# EasyEDA schematic SCH_SQIQ pod_2022-06-01.json
TITLE: Sheet_1; REV: 1.0; Date: 2022-06-01; Sheet: 1/1; Drawn By: suja8742; Company: Your Company
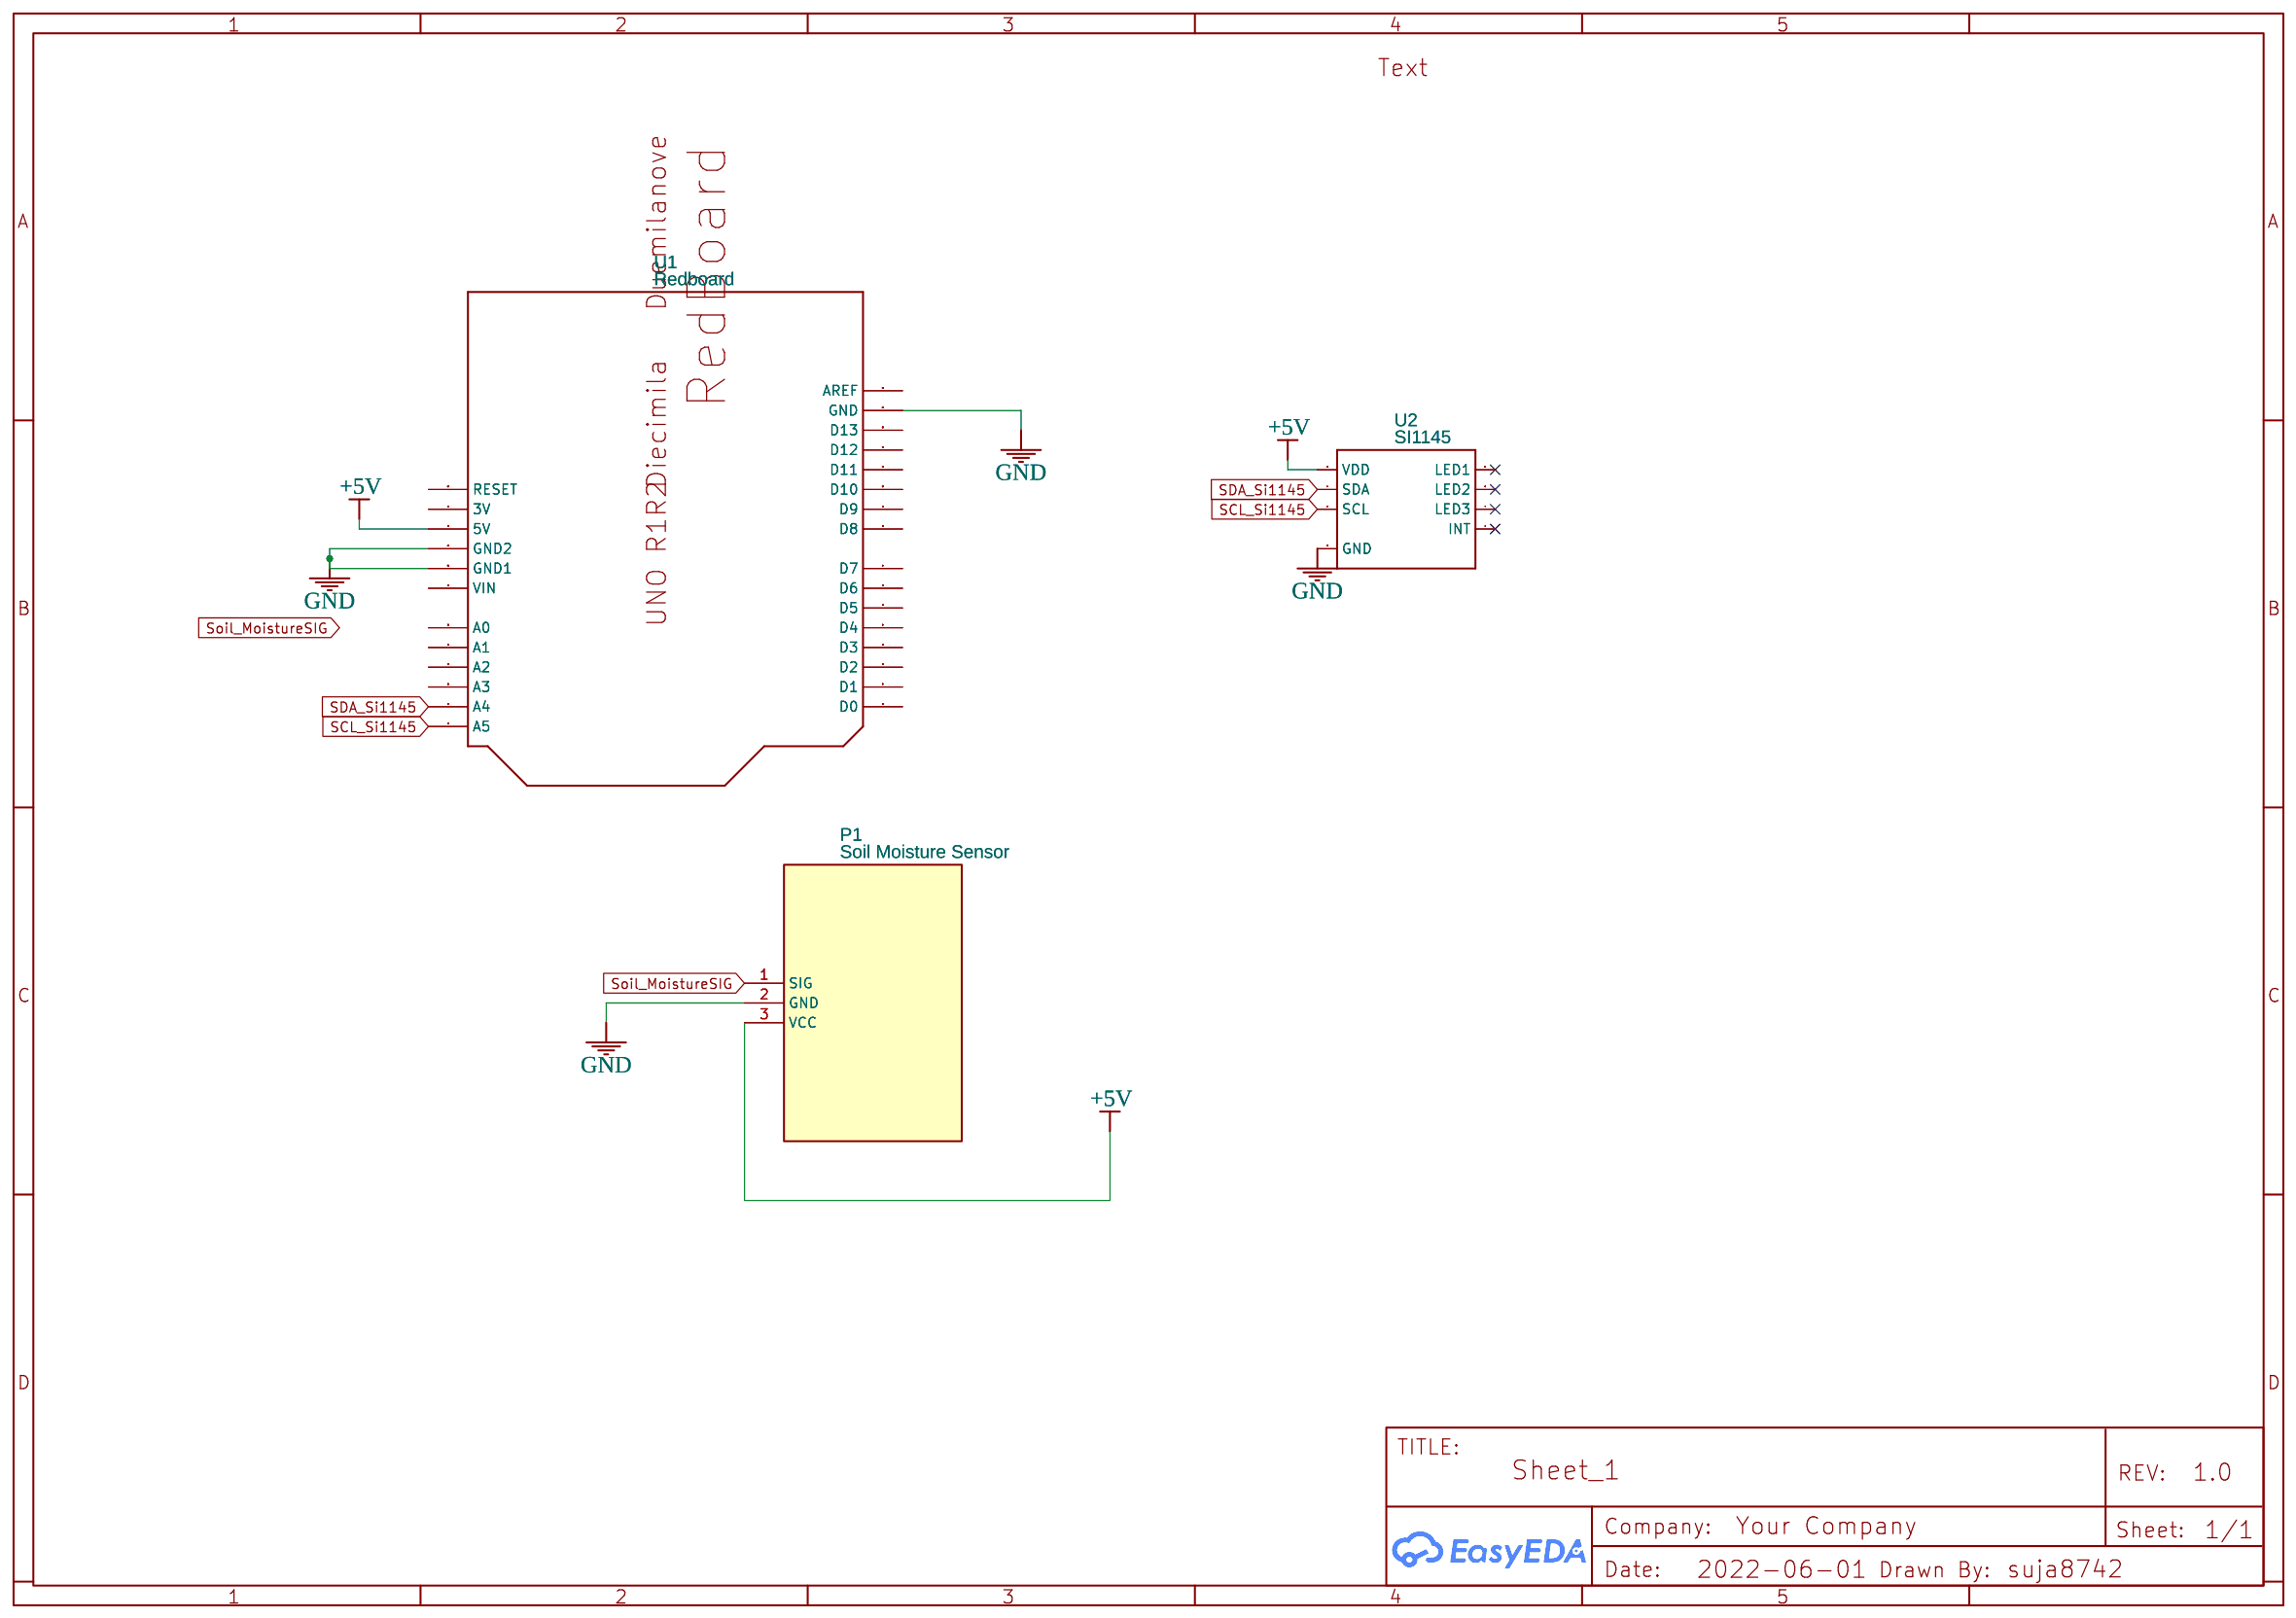
[diagram p0: schematic sheet]

## Parts
P1  Soil Moisture Sensor  [SOIL MOISTURE SENSOR]
U1  Redboard  [ARDUINO]
U2  SI1145  [QFN-10-SI1145]

## Library data of the parts
P1 = Soil Moisture Sensor: sourceId: i6oizRL3l; Supplier Part: 12587; Supplier: SparkFun
U1 = ARDUINOUNO: Arduino DiecimilaDuemilanove; Contributor: Adafruit
U2 = SI1145: Contributor: Pinoccio

## Nets
+5V: P1.3(VCC) U1.5V U2.3(VDD)
GND: P1.2(GND) U1.GND U1.GND1 U1.GND2 U2.8(GND)
SCL_Si1145: U1.A5 U2.2(SCL)
SDA_Si1145: U1.A4 U2.1(SDA)
Soil_MoistureSIG: P1.1(SIG)

Not connected (* = marked no-connect by the designer): U1 3V A0 A1 A2 A3 AREF D0 D1 D2 D3 D4 D5 D6 D7 D8 D9 D10 D11 D12 D13 RESET VIN; U2 4(INT)* 6(LED2)* 7(LED3)* 9(LED1)*
